# EAGLE schematic smart_probe (EAGLE 9.5.2)
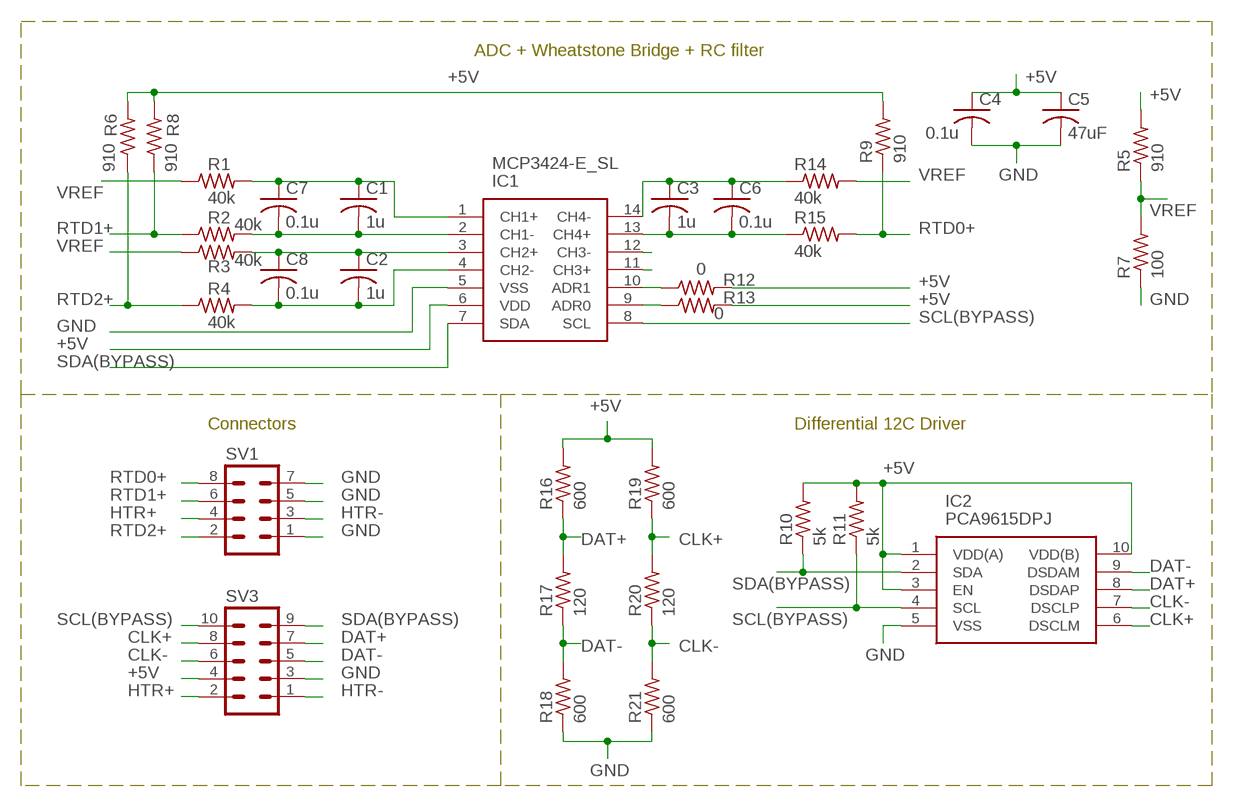
[diagram p0: schematic, sheet 1]

## Parts
C1  1u  C-USC0603  [C0603]
C2  1u  C-USC0603  [C0603]
C3  1u  C-USC0603  [C0603]
C4  0.1u  C-USC0603  [C0603]
C5  47uF  C-USC0603  [C0603]
C6  0.1u  C-USC0603  [C0603]
C7  0.1u  C-USC0603  [C0603]
C8  0.1u  C-USC0603  [C0603]
IC1  MCP3424-E_SL  [SOIC127P600X175-14N]
IC2  PCA9615DPJ  [SOP50P490X110-10N]
R1  40k  R-US_R0603  [R0603]
R2  40k  R-US_R0603  [R0603]
R3  40k  R-US_R0603  [R0603]
R4  40k  R-US_R0603  [R0603]
R5  910  R-US_R0603  [R0603]
R6  910  R-US_R0603  [R0603]
R7  100  R-US_R0603  [R0603]
R8  910  R-US_R0603  [R0603]
R9  910  R-US_R0603  [R0603]
R10  5k  R-US_R0603  [R0603]
R11  5k  R-US_R0603  [R0603]
R12  0  R-US_R0603  [R0603]
R13  0  R-US_R0603  [R0603]
R14  40k  R-US_R0603  [R0603]
R15  40k  R-US_R0603  [R0603]
R16  600  R-US_R0603  [R0603]
R17  120  R-US_R0603  [R0603]
R18  600  R-US_R0603  [R0603]
R19  600  R-US_R0603  [R0603]
R20  120  R-US_R0603  [R0603]
R21  600  R-US_R0603  [R0603]
SV1  MA04-2  [MA04-2]
SV3  MA05-2  [MA05-2]

## Nets
+5V: C4.1 C5.1 IC1.6(VDD) IC2.1(VDD(A)) IC2.3(EN) IC2.10(VDD(B)) R5.2 R6.2 R8.2 R9.2 R10.2 R11.2 R12.2 R13.2 R16.2 R19.2 SV3.4
ADR0: IC1.9(ADR0) R13.1
ADR1: IC1.10(ADR1) R12.1
CH1+: C1.1 C7.1 IC1.1(CH1+) R1.2
CH1-: C1.2 C7.2 IC1.2(CH1-) R2.2
CH2+: C2.1 C8.1 IC1.3(CH2+) R3.2
CH2-: C2.2 C8.2 IC1.4(CH2-) R4.2
CH3+: IC1.11(CH3+)
CH3-: IC1.12(CH3-)
CH4+: C3.2 C6.2 IC1.13(CH4+) R15.1
CH4-: C3.1 C6.1 IC1.14(CH4-) R14.1
CLK+: IC2.6(DSCLM) R19.1 R20.2 SV3.8
CLK-: IC2.7(DSCLP) R20.1 R21.2 SV3.6
DAT+: IC2.8(DSDAP) R16.1 R17.2 SV3.7
DAT-: IC2.9(DSDAM) R17.1 R18.2 SV3.5
GND: C4.2 C5.2 IC1.5(VSS) IC2.5(VSS) R7.1 R18.1 R21.1 SV1.1 SV1.5 SV1.7 SV3.3
HTR+: SV1.4 SV3.2
HTR-: SV1.3 SV3.1
RTD0+: R9.1 R15.2 SV1.8
RTD1+: R2.1 R8.1 SV1.6
RTD2+: R4.1 R6.1 SV1.2
SCL(BYPASS): IC1.8(SCL) IC2.4(SCL) R11.1 SV3.10
SDA(BYPASS): IC1.7(SDA) IC2.2(SDA) R10.1 SV3.9
VREF: R1.1 R3.1 R5.1 R7.2 R14.2

## Notes on the sheet
- ADC + Wheatstone Bridge + RC filter
- Connectors | Differential 12C Driver

## Library data of the parts
C1-C8 = rcl:C-US: CAPACITOR, American symbol; SPICEPREFIX: C
IC1 = MCP3424-E_SL:MCP3424-E_SL: ADC 18-Bit 4-ch 2.048V I2C SOIC14 Source: Datasheet <http://ww1.microchip.com/downloads/en/DeviceDoc/22088c.pdf>; ALLIED_NUMBER: 70046797; ALLIED_PRICE-STOCK: http://www.alliedelec.com/microchip-technology-inc-mcp3424-e-sl/70046797/; DESCRIPTION: ADC 18-Bit 4-ch 2.048V I2C SOIC14; HEIGHT: 1.75mm; MANUFACTURER_NAME: Microchip; MANUFACTURER_PART_NUMBER: MCP3424-E/SL; MOUSER_PART_NUMBER: 579-MCP3424-E/SL; MOUSER_PRICE-STOCK: https://www.mouser.com/Search/Refine.aspx?Keyword=579-MCP3424-E%2FSL; RS_PART_NUMBER: 6696086P; RS_PRICE-STOCK: http://uk.rs-online.com/web/p/products/6696086P
IC2 = PCA9615DPJ:PCA9615DPJ: NXP - PCA9615DPJ - BUFFER, DIFFERENTIAL I2C-BUS, TSSOP-10 Source: Datasheet <https://rs.componentsearchengine.com/Datasheets/2/PCA9615DPJ.pdf>; DESCRIPTION: NXP - PCA9615DPJ - BUFFER, DIFFERENTIAL I2C-BUS, TSSOP-10; HEIGHT: 1.1mm; MANUFACTURER_NAME: Nexperia; MANUFACTURER_PART_NUMBER: PCA9615DPJ; MOUSER_PART_NUMBER: 771-PCA9615DPJ; MOUSER_PRICE-STOCK: https://www.mouser.com/Search/Refine.aspx?Keyword=771-PCA9615DPJ
R1-R21 = rcl:R-US_: RESISTOR, American symbol; SPICEPREFIX: R
SV1 = con-lstb:MA04-2: PIN HEADER; OC_FARNELL: unknown; OC_NEWARK: unknown
SV3 = con-lstb:MA05-2: PIN HEADER; OC_FARNELL: unknown; OC_NEWARK: unknown

## Module ADC
Ports: RTD1(io) RTD2(io) RTD3(io) AGND(io) +5V(io) GND(io) SCL1(io) SDA1(io) RDY1(io) SCL2(io) SDA2(io) RDY2(io)
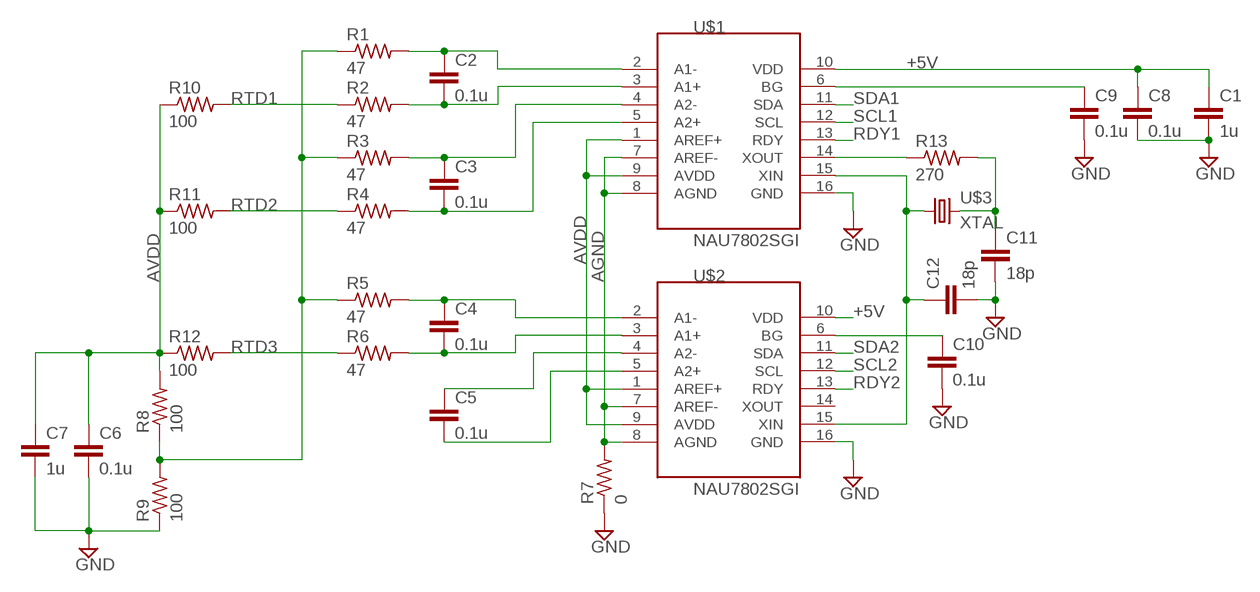
[diagram p1: schematic, module ADC, sheet 1]

### Parts
C1  1u  C-EUC0603  [C0603]
C2  0.1u  C-EUC0603  [C0603]
C3  0.1u  C-EUC0603  [C0603]
C4  0.1u  C-EUC0603  [C0603]
C5  0.1u  C-EUC0603  [C0603]
C6  0.1u  C-EUC0603  [C0603]
C7  1u  C-EUC0603  [C0603]
C8  0.1u  C-EUC0603  [C0603]
C9  0.1u  C-EUC0603  [C0603]
C10  0.1u  C-EUC0603  [C0603]
C11  18p  C-EUC0603  [C0603]
C12  18p  C-EUC0603  [C0603]
R1  47  R-US_R0603  [R0603]
R2  47  R-US_R0603  [R0603]
R3  47  R-US_R0603  [R0603]
R4  47  R-US_R0603  [R0603]
R5  47  R-US_R0603  [R0603]
R6  47  R-US_R0603  [R0603]
R7  0  R-US_R0603  [R0603]
R8  100  R-US_R0603  [R0603]
R9  100  R-US_R0603  [R0603]
R10  100  R-US_R0603  [R0603]
R11  100  R-US_R0603  [R0603]
R12  100  R-US_R0603  [R0603]
R13  270  R-US_R0603  [R0603]
U$1  NAU7802SGI  [SOIC127P600X175-16N]
U$2  NAU7802SGI  [SOIC127P600X175-16N]
U$3  XTAL  [XTAL1140X470X420N]

### Nets
+5V: C1.1 C8.1 U$1.10(VDD) U$2.10(VDD)
AGND: R7.2 U$1.7(AREF-) U$1.8(AGND) U$2.7(AREF-) U$2.8(AGND)
AVDD: C6.1 C7.1 R8.2 R10.1 R11.1 R12.1 U$1.1(AREF+) U$1.9(AVDD) U$2.1(AREF+) U$2.9(AVDD)
GND: C1.2 C6.2 C7.2 C8.2 C9.2 C10.2 C11.2 C12.2 R7.1 R9.1 U$1.16(GND) U$2.16(GND)
N$1: C2.1 R1.2 U$1.2(A1-)
N$2: C2.2 R2.2 U$1.3(A1+)
N$3: C9.1 U$1.6(BG)
N$4: C3.1 R3.2 U$1.4(A2-)
N$5: C3.2 R4.2 U$1.5(A2+)
N$6: R1.1 R3.1 R5.1 R8.1 R9.2
N$7: C4.1 R5.2 U$2.2(A1-)
N$8: C4.2 R6.2 U$2.3(A1+)
N$9: C5.1 U$2.4(A2-)
N$10: C5.2 U$2.5(A2+)
N$11: C12.1 U$1.15(XIN) U$2.15(XIN) U$3.1
N$12: C10.1 U$2.6(BG)
N$13: R13.1 U$1.14(XOUT)
N$14: C11.1 R13.2 U$3.2
RDY1: U$1.13(RDY)
RDY2: U$2.13(RDY)
RTD1: R2.1 R10.2
RTD2: R4.1 R11.2
RTD3: R6.1 R12.2
SCL1: U$1.12(SCL)
SCL2: U$2.12(SCL)
SDA1: U$1.11(SDA)
SDA2: U$2.11(SDA)
Unconnected: U$2.14(XOUT)

### Library data of the parts
C1-C12 = rcl:C-EU: CAPACITOR, European symbol; SPICEPREFIX: C
R1-R13 = rcl:R-US_: RESISTOR, American symbol; SPICEPREFIX: R
U$1 U$2 = sapflow:NAU7802SGI
U$3 = sapflow:XTAL